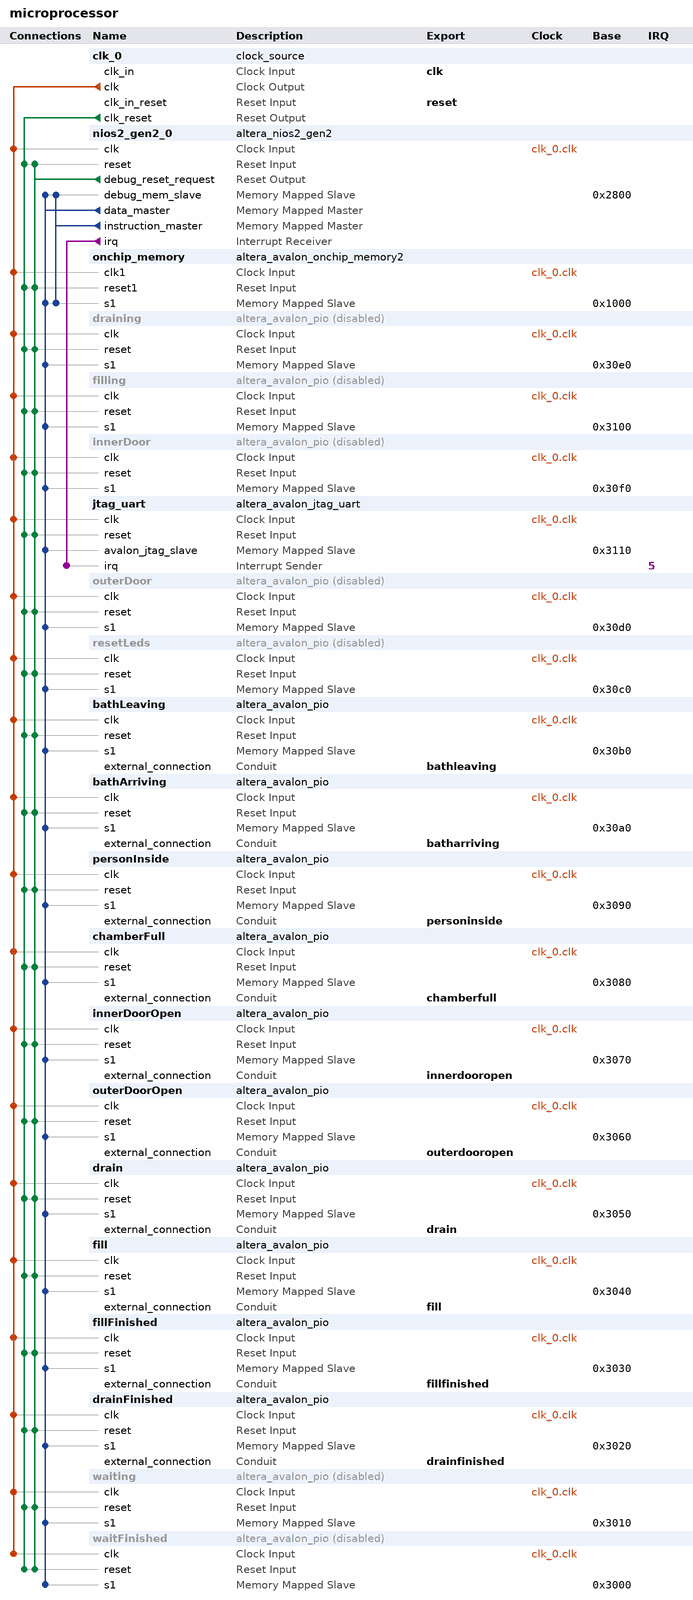
[diagram p0: system contents]
# Platform Designer (Qsys) system microprocessor, Cyclone V 5CSEMA5F31C6
# Parameters at their usual value, and those the tool derives, are not listed.
package require -exact qsys 15.1
create_system microprocessor
set_project_property DEVICE_FAMILY {Cyclone V}
set_project_property DEVICE 5CSEMA5F31C6

add_instance clk_0 clock_source 15.1
set_instance_parameter_value clk_0 clockFrequency 50000000

add_instance nios2_gen2_0 altera_nios2_gen2 15.1
set_instance_parameter_value nios2_gen2_0 dcache_size 2048
set_instance_parameter_value nios2_gen2_0 exceptionSlave onchip_memory.s1
set_instance_parameter_value nios2_gen2_0 icache_size 4096
set_instance_parameter_value nios2_gen2_0 impl Fast
set_instance_parameter_value nios2_gen2_0 resetSlave onchip_memory.s1

add_instance onchip_memory altera_avalon_onchip_memory2 15.1
set_instance_parameter_value onchip_memory dataWidth 32
set_instance_parameter_value onchip_memory dualPort false
set_instance_parameter_value onchip_memory initMemContent true
set_instance_parameter_value onchip_memory initializationFileName onchip_mem.hex
set_instance_parameter_value onchip_memory memorySize 4096

add_instance draining altera_avalon_pio 15.1
set_instance_property draining ENABLED false
set_instance_parameter_value draining direction Input
set_instance_parameter_value draining width 1

add_instance filling altera_avalon_pio 15.1
set_instance_property filling ENABLED false
set_instance_parameter_value filling direction Input
set_instance_parameter_value filling width 1

add_instance innerDoor altera_avalon_pio 15.1
set_instance_property innerDoor ENABLED false
set_instance_parameter_value innerDoor direction Input
set_instance_parameter_value innerDoor width 1

add_instance jtag_uart altera_avalon_jtag_uart 15.1
set_instance_parameter_value jtag_uart simInteractiveOptions NO_INTERACTIVE_WINDOWS

add_instance outerDoor altera_avalon_pio 15.1
set_instance_property outerDoor ENABLED false
set_instance_parameter_value outerDoor direction Input
set_instance_parameter_value outerDoor width 1

add_instance resetLeds altera_avalon_pio 15.1
set_instance_property resetLeds ENABLED false
set_instance_parameter_value resetLeds direction Input
set_instance_parameter_value resetLeds width 4

add_instance bathLeaving altera_avalon_pio 15.1
set_instance_parameter_value bathLeaving direction Output
set_instance_parameter_value bathLeaving width 1

add_instance bathArriving altera_avalon_pio 15.1
set_instance_parameter_value bathArriving direction Output
set_instance_parameter_value bathArriving width 1

add_instance personInside altera_avalon_pio 15.1
set_instance_parameter_value personInside direction Output
set_instance_parameter_value personInside width 1

add_instance chamberFull altera_avalon_pio 15.1
set_instance_parameter_value chamberFull direction Output
set_instance_parameter_value chamberFull width 1

add_instance innerDoorOpen altera_avalon_pio 15.1
set_instance_parameter_value innerDoorOpen direction Output
set_instance_parameter_value innerDoorOpen width 1

add_instance outerDoorOpen altera_avalon_pio 15.1
set_instance_parameter_value outerDoorOpen direction Output
set_instance_parameter_value outerDoorOpen width 1

add_instance drain altera_avalon_pio 15.1
set_instance_parameter_value drain direction Output
set_instance_parameter_value drain width 1

add_instance fill altera_avalon_pio 15.1
set_instance_parameter_value fill direction Output
set_instance_parameter_value fill width 1

add_instance fillFinished altera_avalon_pio 15.1
set_instance_parameter_value fillFinished direction Output
set_instance_parameter_value fillFinished width 1

add_instance drainFinished altera_avalon_pio 15.1
set_instance_parameter_value drainFinished direction Output
set_instance_parameter_value drainFinished width 1

add_instance waiting altera_avalon_pio 15.1
set_instance_property waiting ENABLED false
set_instance_parameter_value waiting direction Input
set_instance_parameter_value waiting width 1

add_instance waitFinished altera_avalon_pio 15.1
set_instance_property waitFinished ENABLED false
set_instance_parameter_value waitFinished direction Output
set_instance_parameter_value waitFinished width 1

# connections
add_connection clk_0.clk bathArriving.clk clock
add_connection clk_0.clk bathLeaving.clk clock
add_connection clk_0.clk chamberFull.clk clock
add_connection clk_0.clk drain.clk clock
add_connection clk_0.clk drainFinished.clk clock
add_connection clk_0.clk draining.clk clock
add_connection clk_0.clk fill.clk clock
add_connection clk_0.clk fillFinished.clk clock
add_connection clk_0.clk filling.clk clock
add_connection clk_0.clk innerDoor.clk clock
add_connection clk_0.clk innerDoorOpen.clk clock
add_connection clk_0.clk jtag_uart.clk clock
add_connection clk_0.clk nios2_gen2_0.clk clock
add_connection clk_0.clk onchip_memory.clk1 clock
add_connection clk_0.clk outerDoor.clk clock
add_connection clk_0.clk outerDoorOpen.clk clock
add_connection clk_0.clk personInside.clk clock
add_connection clk_0.clk resetLeds.clk clock
add_connection clk_0.clk waitFinished.clk clock
add_connection clk_0.clk waiting.clk clock
add_connection clk_0.clk_reset bathArriving.reset reset
add_connection clk_0.clk_reset bathLeaving.reset reset
add_connection clk_0.clk_reset chamberFull.reset reset
add_connection clk_0.clk_reset drain.reset reset
add_connection clk_0.clk_reset drainFinished.reset reset
add_connection clk_0.clk_reset draining.reset reset
add_connection clk_0.clk_reset fill.reset reset
add_connection clk_0.clk_reset fillFinished.reset reset
add_connection clk_0.clk_reset filling.reset reset
add_connection clk_0.clk_reset innerDoor.reset reset
add_connection clk_0.clk_reset innerDoorOpen.reset reset
add_connection clk_0.clk_reset jtag_uart.reset reset
add_connection clk_0.clk_reset nios2_gen2_0.reset reset
add_connection clk_0.clk_reset onchip_memory.reset1 reset
add_connection clk_0.clk_reset outerDoor.reset reset
add_connection clk_0.clk_reset outerDoorOpen.reset reset
add_connection clk_0.clk_reset personInside.reset reset
add_connection clk_0.clk_reset resetLeds.reset reset
add_connection clk_0.clk_reset waitFinished.reset reset
add_connection clk_0.clk_reset waiting.reset reset
add_connection nios2_gen2_0.debug_reset_request bathArriving.reset reset
add_connection nios2_gen2_0.debug_reset_request bathLeaving.reset reset
add_connection nios2_gen2_0.debug_reset_request chamberFull.reset reset
add_connection nios2_gen2_0.debug_reset_request drain.reset reset
add_connection nios2_gen2_0.debug_reset_request drainFinished.reset reset
add_connection nios2_gen2_0.debug_reset_request draining.reset reset
add_connection nios2_gen2_0.debug_reset_request fill.reset reset
add_connection nios2_gen2_0.debug_reset_request fillFinished.reset reset
add_connection nios2_gen2_0.debug_reset_request filling.reset reset
add_connection nios2_gen2_0.debug_reset_request innerDoor.reset reset
add_connection nios2_gen2_0.debug_reset_request innerDoorOpen.reset reset
add_connection nios2_gen2_0.debug_reset_request jtag_uart.reset reset
add_connection nios2_gen2_0.debug_reset_request nios2_gen2_0.reset reset
add_connection nios2_gen2_0.debug_reset_request onchip_memory.reset1 reset
add_connection nios2_gen2_0.debug_reset_request outerDoor.reset reset
add_connection nios2_gen2_0.debug_reset_request outerDoorOpen.reset reset
add_connection nios2_gen2_0.debug_reset_request personInside.reset reset
add_connection nios2_gen2_0.debug_reset_request resetLeds.reset reset
add_connection nios2_gen2_0.debug_reset_request waitFinished.reset reset
add_connection nios2_gen2_0.debug_reset_request waiting.reset reset
add_connection nios2_gen2_0.data_master bathArriving.s1 avalon
set_connection_parameter_value nios2_gen2_0.data_master/bathArriving.s1 baseAddress 0x30a0
add_connection nios2_gen2_0.data_master bathLeaving.s1 avalon
set_connection_parameter_value nios2_gen2_0.data_master/bathLeaving.s1 baseAddress 0x30b0
add_connection nios2_gen2_0.data_master chamberFull.s1 avalon
set_connection_parameter_value nios2_gen2_0.data_master/chamberFull.s1 baseAddress 0x3080
add_connection nios2_gen2_0.data_master drain.s1 avalon
set_connection_parameter_value nios2_gen2_0.data_master/drain.s1 baseAddress 0x3050
add_connection nios2_gen2_0.data_master drainFinished.s1 avalon
set_connection_parameter_value nios2_gen2_0.data_master/drainFinished.s1 baseAddress 0x3020
add_connection nios2_gen2_0.data_master draining.s1 avalon
set_connection_parameter_value nios2_gen2_0.data_master/draining.s1 baseAddress 0x30e0
add_connection nios2_gen2_0.data_master fill.s1 avalon
set_connection_parameter_value nios2_gen2_0.data_master/fill.s1 baseAddress 0x3040
add_connection nios2_gen2_0.data_master fillFinished.s1 avalon
set_connection_parameter_value nios2_gen2_0.data_master/fillFinished.s1 baseAddress 0x3030
add_connection nios2_gen2_0.data_master filling.s1 avalon
set_connection_parameter_value nios2_gen2_0.data_master/filling.s1 baseAddress 0x3100
add_connection nios2_gen2_0.data_master innerDoor.s1 avalon
set_connection_parameter_value nios2_gen2_0.data_master/innerDoor.s1 baseAddress 0x30f0
add_connection nios2_gen2_0.data_master innerDoorOpen.s1 avalon
set_connection_parameter_value nios2_gen2_0.data_master/innerDoorOpen.s1 baseAddress 0x3070
add_connection nios2_gen2_0.data_master jtag_uart.avalon_jtag_slave avalon
set_connection_parameter_value nios2_gen2_0.data_master/jtag_uart.avalon_jtag_slave baseAddress 0x3110
add_connection nios2_gen2_0.data_master nios2_gen2_0.debug_mem_slave avalon
set_connection_parameter_value nios2_gen2_0.data_master/nios2_gen2_0.debug_mem_slave baseAddress 0x2800
add_connection nios2_gen2_0.data_master onchip_memory.s1 avalon
set_connection_parameter_value nios2_gen2_0.data_master/onchip_memory.s1 baseAddress 0x1000
add_connection nios2_gen2_0.data_master outerDoor.s1 avalon
set_connection_parameter_value nios2_gen2_0.data_master/outerDoor.s1 baseAddress 0x30d0
add_connection nios2_gen2_0.data_master outerDoorOpen.s1 avalon
set_connection_parameter_value nios2_gen2_0.data_master/outerDoorOpen.s1 baseAddress 0x3060
add_connection nios2_gen2_0.data_master personInside.s1 avalon
set_connection_parameter_value nios2_gen2_0.data_master/personInside.s1 baseAddress 0x3090
add_connection nios2_gen2_0.data_master resetLeds.s1 avalon
set_connection_parameter_value nios2_gen2_0.data_master/resetLeds.s1 baseAddress 0x30c0
add_connection nios2_gen2_0.data_master waitFinished.s1 avalon
set_connection_parameter_value nios2_gen2_0.data_master/waitFinished.s1 baseAddress 0x3000
add_connection nios2_gen2_0.data_master waiting.s1 avalon
set_connection_parameter_value nios2_gen2_0.data_master/waiting.s1 baseAddress 0x3010
add_connection nios2_gen2_0.instruction_master nios2_gen2_0.debug_mem_slave avalon
set_connection_parameter_value nios2_gen2_0.instruction_master/nios2_gen2_0.debug_mem_slave baseAddress 0x2800
add_connection nios2_gen2_0.instruction_master onchip_memory.s1 avalon
set_connection_parameter_value nios2_gen2_0.instruction_master/onchip_memory.s1 baseAddress 0x1000
add_connection nios2_gen2_0.irq jtag_uart.irq interrupt
set_connection_parameter_value nios2_gen2_0.irq/jtag_uart.irq irqNumber 5

# exported interfaces
add_interface batharriving conduit end
set_interface_property batharriving EXPORT_OF bathArriving.external_connection
add_interface bathleaving conduit end
set_interface_property bathleaving EXPORT_OF bathLeaving.external_connection
add_interface chamberfull conduit end
set_interface_property chamberfull EXPORT_OF chamberFull.external_connection
add_interface clk clock sink
set_interface_property clk EXPORT_OF clk_0.clk_in
add_interface drain conduit end
set_interface_property drain EXPORT_OF drain.external_connection
add_interface drainfinished conduit end
set_interface_property drainfinished EXPORT_OF drainFinished.external_connection
add_interface fill conduit end
set_interface_property fill EXPORT_OF fill.external_connection
add_interface fillfinished conduit end
set_interface_property fillfinished EXPORT_OF fillFinished.external_connection
add_interface innerdooropen conduit end
set_interface_property innerdooropen EXPORT_OF innerDoorOpen.external_connection
add_interface outerdooropen conduit end
set_interface_property outerdooropen EXPORT_OF outerDoorOpen.external_connection
add_interface personinside conduit end
set_interface_property personinside EXPORT_OF personInside.external_connection
add_interface reset reset sink
set_interface_property reset EXPORT_OF clk_0.clk_in_reset

set_interconnect_requirement {$system} qsys_mm.clockCrossingAdapter HANDSHAKE
set_interconnect_requirement {$system} qsys_mm.enableEccProtection FALSE
set_interconnect_requirement {$system} qsys_mm.insertDefaultSlave FALSE
set_interconnect_requirement {$system} qsys_mm.maxAdditionalLatency 1

save_system microprocessor.qsys
